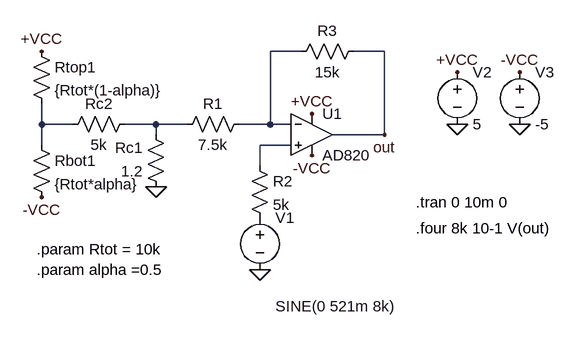
[diagram p0: schematic THD1.asc]
THD1.asc, the LTspice schematic file:
Version 4.1
SHEET 1 880 680
WIRE 368 80 320 80
WIRE 496 80 448 80
WIRE -32 192 -32 160
WIRE 16 192 -32 192
WIRE 144 192 96 192
WIRE 192 192 144 192
WIRE 320 192 320 80
WIRE 320 192 272 192
WIRE 352 192 320 192
WIRE 144 208 144 192
WIRE 496 208 496 80
WIRE 496 208 416 208
WIRE -32 224 -32 192
WIRE 352 224 304 224
WIRE 304 256 304 224
FLAG 144 288 0
FLAG 608 192 0
FLAG 704 192 0
FLAG 304 416 0
FLAG 608 112 +VCC
FLAG 384 176 +VCC
FLAG -32 80 +VCC
FLAG 704 112 -VCC
FLAG 384 240 -VCC
FLAG -32 304 -VCC
FLAG 496 208 out
SYMBOL OpAmps\\AD820 384 144 R0
SYMATTR InstName U1
SYMBOL res 288 176 R90
WINDOW 0 0 56 VBottom 2
WINDOW 3 32 56 VTop 2
SYMATTR InstName R1
SYMATTR Value 7.5k
SYMBOL res 160 304 R180
WINDOW 0 36 76 Left 2
WINDOW 3 36 40 Left 2
SYMATTR InstName Rc1
SYMATTR Value 1.2
SYMBOL res 0 208 R270
WINDOW 0 32 56 VTop 2
WINDOW 3 0 56 VBottom 2
SYMATTR InstName Rc2
SYMATTR Value 5k
SYMBOL res -48 64 R0
SYMATTR InstName Rtop1
SYMATTR Value {Rtot*(1-alpha)}
SYMBOL res -48 208 R0
SYMATTR InstName Rbot1
SYMATTR Value {Rtot*alpha}
SYMBOL res 288 240 R0
SYMATTR InstName R2
SYMATTR Value 5k
SYMBOL res 464 64 R90
WINDOW 0 0 56 VBottom 2
WINDOW 3 32 56 VTop 2
SYMATTR InstName R3
SYMATTR Value 15k
SYMBOL voltage 304 320 R0
WINDOW 3 24 152 Left 2
WINDOW 123 24 124 Left 2
WINDOW 39 0 0 Left 0
SYMATTR Value SINE(0 521m 8k)
SYMATTR InstName V1
SYMBOL voltage 608 96 R0
SYMATTR InstName V2
SYMATTR Value 5
SYMBOL voltage 704 96 R0
SYMATTR InstName V3
SYMATTR Value -5
TEXT -40 384 Left 2 !.param Rtot = 10k
TEXT -40 416 Left 2 !.param alpha =0.5
TEXT 544 352 Left 2 !.four 8k 10-1 V(out)
TEXT 544 312 Left 2 !.tran 0 10m 0

The netlist it stands for:
* THD1.asc
X§U1 N004 N001 +VCC -VCC out AD820  ; pins In+ In- V+ V- OUT
R1 N001 N003 7.5k
Rc1 0 N003 1.2
Rc2 N002 N003 5k
Rtop1 +VCC N002 {Rtot*(1-alpha)}
Rbot1 N002 -VCC {Rtot*alpha}
R2 N004 P001 5k
R3 out N001 15k
V1 P001 0 SINE(0 521m 8k)
V2 +VCC 0 5
V3 -VCC 0 -5
.param Rtot = 10k
.param alpha =0.5
.four 8k 10-1 V(out)
.tran 0 10m 0
.backanno
.end